# Altium schematic sheet LED_DRIVER.SchDoc
size 299 x 199 mm
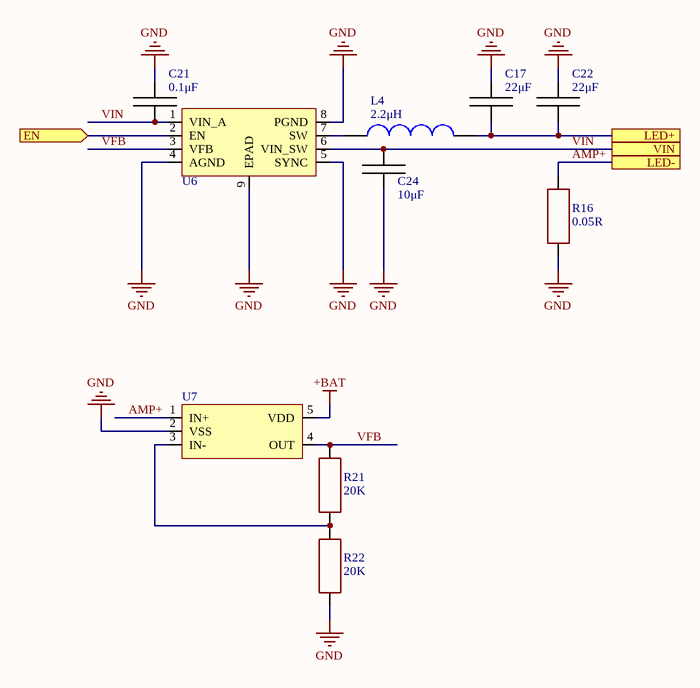
[diagram p0: LED_DRIVER.SchDoc]

## Parts
C17  value 22μF  [CAP: 0603]  (hidden comment: Cap_0603)
C21  value 0.1μF  [CAP: 0402]  (hidden comment: Cap_0402)
C22  value 22μF  [CAP: 0603]  (hidden comment: Cap_0603)
C24  value 10μF  [CAP: 0603]  (hidden comment: Cap_0603)
L4  value 2.2μH  [CDRH74]  (hidden comment: CDRH74)
R16  value 0.05R  [RES: 2010]  (hidden comment: Resistor_2512)
R21  value 20K  [RES: 0402]
R22  value 20K  [RES: 0402]
U6  ST1S10PUR  [DFN8(4x4)]  (value not drawn)
U7  MCP6001U  [SOT-23-5]  (value not drawn)

## Ports
EN (in), LED+, LED-, VIN

## Nets
+BAT: U7.5(VDD)
GND: C17.1 C21.2 C22.1 C24.1 R16.1 R22.1 U6.4(AGND) U6.5(SYNC) U6.8(PGND) U6.9(EPAD) U7.2(VSS)
AMP+: R16.2 U7.1(IN+) ; port LED-
EN: U6.2(EN) ; port EN
LED+: C17.2 C22.2 L4.1 ; port LED+
VFB: R21.2 U6.3(VFB) U7.4(OUT)
VIN: C21.1 C24.2 U6.1(VIN_A) U6.6(VIN_SW) ; port VIN
NetL4_2: L4.2 U6.7(SW)
NetR21_1: R21.1 R22.2 U7.3(IN-)

## Library data of the parts
C17 C22 C24 = Cap_0603: TypeDielectric: X7R(X5R); Voltage: ??V; Package/Case: 0603; Temperature: -55...+125°C(-55...+85°C); Product Category: Capacitors
C21 = Cap_0402: TypeDielectric: X7R(X5R); Voltage: ??V; Package/Case: 0402; Temperature: -55...+125°C(-55...+85°C); Product Category: Capacitors
L4 = CDRH74: SMD Power Inductor; Manufacturer: SUMIDA; Datasheet: https://radiokomponent.com.ua/pdf/trans/CDRH74.pdf; HelpURL: https://aliexpress.ru/item/1005004321960425.html?sku_id=12000028751500104&spm=a2g2w.productlist.search_results.7.529b6cc4mPaVds; Product Category: Inductors
R16 = Resistor_2010: Tolerance: ±5%; Package/Case: 2010; Temperature: -55...+125°C; Product Category: Resistors
R21 R22 = Resistor_0402: Tolerance: ±5%; Product Category: Resistors; Package/Case: 0402; Temperature: -55...+125°C
U6 = ST1S10PUR: Step-down current mode PWM regulator; Manufacturer: STMicroelectronics; Datasheet: https://static.chipdip.ru/lib/421/DOC025421412.pdf; HelpURL: https://www.chipdip.by/product/st1s10pur; Package/Case: DFN8 (4x4); Product Category: PWM regulators; Value: ST1S10PUR
U7 = MCP6001U: 1 MHz, Low-Power Op Amp; Manufacturer: Microchip; Datasheet: https://eu.mouser.com/ProductDetail/Microchip-Technology-Atmel/MCP6004-I-SL?qs=n%2FfJlMG9rCZ2%2F%2FCryvZ52w%3D%3D; HelpURL: https://eu.mouser.com/ProductDetail/Microchip-Technology-Atmel/MCP6001UT-I-OT?qs=Sez7gRs8XSU2iw24kVuIOw%3D%3D; Package/Case: SOT-23-5; Product Category: Operational Amplifiers; Value: MCP6001U